# EAGLE schematic XbeeToI2C (EAGLE 7.1.0)
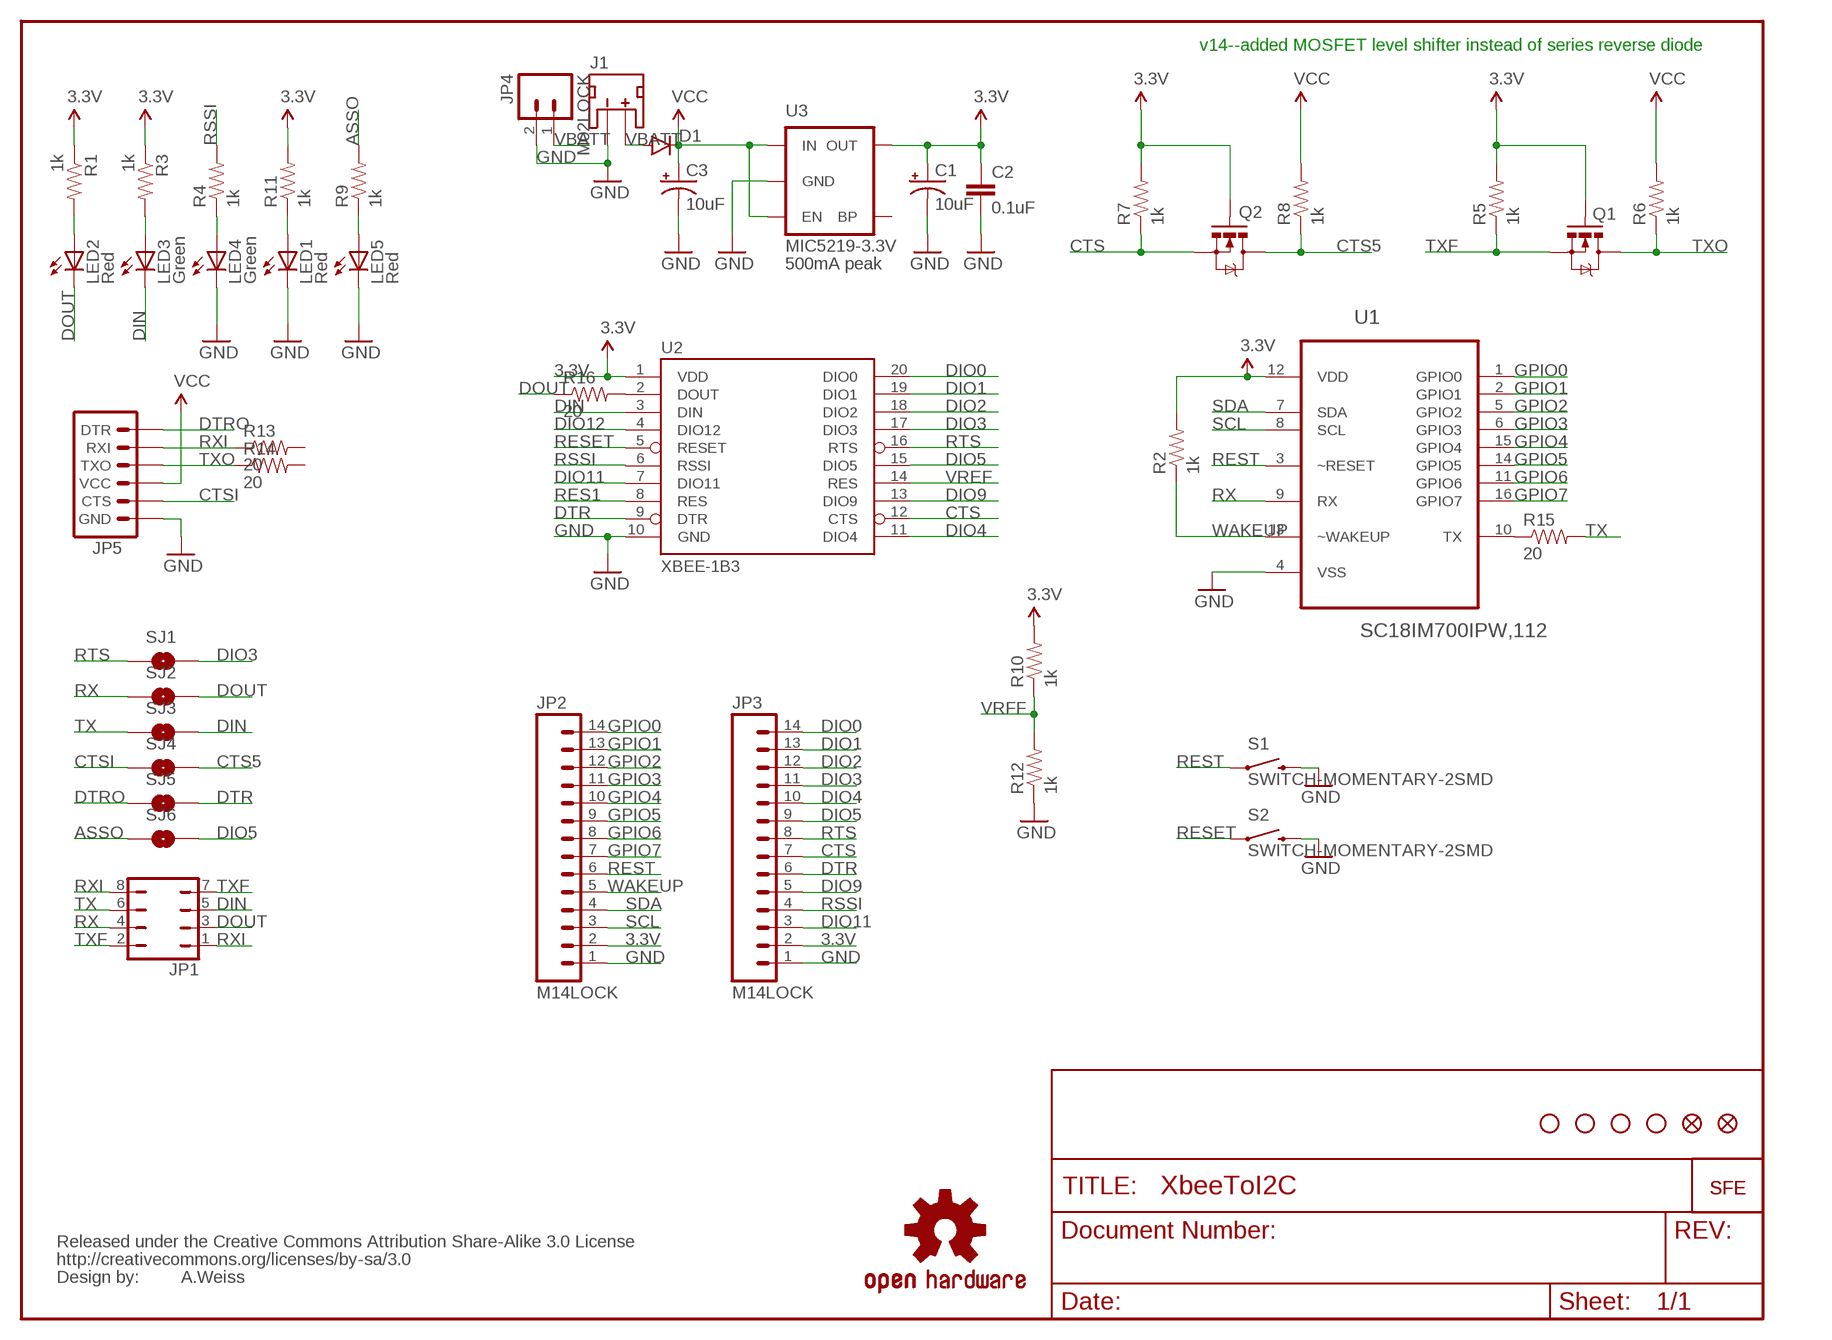
[diagram p0: schematic, sheet 1]

## Parts
C1  10uF  CAP_POL1206  [EIA3216]
C2  0.1uF  CAP0402-CAP  [0402-CAP]
C3  10uF  CAP_POL1206  [EIA3216]
D1  DIODESMA  [SMA-DIODE]
J1  JST_2MM_MALE  [JST-2-SMD]
JP1  JP4Q  [JP4Q]
JP2  M14LOCK  [1X14_LOCK]
JP3  M14LOCK  [1X14_LOCK]
JP4  M02LOCK  [1X02_LOCK]
JP5  ARDUINO_SERIAL_PROGRAMSMD  [1X06-SMD]
LED1  Red  LED0603  [LED-0603]
LED2  Red  LED0603  [LED-0603]
LED3  Green  LED0603  [LED-0603]
LED4  Green  LED0603  [LED-0603]
LED5  Red  LED0603  [LED-0603]
Q1  MOSFET-NCHANNELSMD  [SOT23-3@1]
Q2  MOSFET-NCHANNELSMD  [SOT23-3@1]
R1  1k  RESISTOR0402-RES  [0402-RES]
R2  1k  RESISTOR0402-RES  [0402-RES]
R3  1k  RESISTOR0402-RES  [0402-RES]
R4  1k  RESISTOR0402-RES  [0402-RES]
R5  1k  RESISTOR0402-RES  [0402-RES]
R6  1k  RESISTOR0402-RES  [0402-RES]
R7  1k  RESISTOR0402-RES  [0402-RES]
R8  1k  RESISTOR0402-RES  [0402-RES]
R9  1k  RESISTOR0402-RES  [0402-RES]
R10  1k  RESISTOR0402-RES  [0402-RES]
R11  1k  RESISTOR0402-RES  [0402-RES]
R12  1k  RESISTOR0402-RES  [0402-RES]
R13  20  20OHM1/10W1%(0603)SMD  [0603-RES]
R14  20  20OHM1/10W1%(0603)SMD  [0603-RES]
R15  20  20OHM1/10W1%(0603)SMD  [0603-RES]
R16  20  20OHM1/10W1%(0603)SMD  [0603-RES]
S1  SWITCH-MOMENTARY-2SMD  [TACTILE-SWITCH-SMD]
S2  SWITCH-MOMENTARY-2SMD  [TACTILE-SWITCH-SMD]
SJ1  SOLDERJUMPERNO  [SJ_2S-NO]
SJ2  SOLDERJUMPERNO  [SJ_2S-NO]
SJ3  SOLDERJUMPERNO  [SJ_2S-NO]
SJ4  SOLDERJUMPERNO  [SJ_2S-NO]
SJ5  SOLDERJUMPERNO  [SJ_2S-NO]
SJ6  SOLDERJUMPERNO  [SJ_2S-NO]
U1  SC18IM700IPW,112  [SOP65P640X110-16N]
U2  XBEE-1B3  [XBEE-SMD]
U3  V_REG_LDOSMD  [SOT23-5]
U$1  LOGO-SFESK  [SFE-LOGO-FLAME]
U$3  OSHW-LOGOS  [OSHW-LOGO-S]
U$4  LOGO-SFENEW  [SFE-NEW-WEBLOGO]
U$5  STAND-OFF  [STAND-OFF]
U$7  FIDUCIAL1X2  [FIDUCIAL-1X2]
U$8  CREATIVE_COMMONS  [CREATIVE_COMMONS]
U$9  STAND-OFF  [STAND-OFF]
U$10  STAND-OFF  [STAND-OFF]
U$11  STAND-OFF  [STAND-OFF]
U$16  FIDUCIAL1X2  [FIDUCIAL-1X2]

## Nets
3.3V [vcc]: C1.A(+) C2.1 JP2.2 JP3.2 Q1.1(G) Q2.1(G) R1.1 R2.2 R3.1 R5.2 R7.2 R10.2 R11.2 U1.12(VDD) U2.1(VDD) U3.5(OUT)
ASSO: R9.2 SJ6.1
CTS: JP3.7 Q2.2(S) R7.1 U2.12(CTS)
CTS5: Q2.3(D) R8.1 SJ4.2
CTSI [vcc]: JP5.5(CTS) SJ4.1
DIN: JP1.5 LED3.C SJ3.2 U2.3(DIN)
DIO0: JP3.14 U2.20(DIO0)
DIO1: JP3.13 U2.19(DIO1)
DIO2: JP3.12 U2.18(DIO2)
DIO3: JP3.11 SJ1.2 U2.17(DIO3)
DIO4: JP3.10 U2.11(DIO4)
DIO5: JP3.9 SJ6.2 U2.15(DIO5)
DIO9: JP3.5 U2.13(DIO9)
DIO11: JP3.3 U2.7(DIO11)
DIO12: U2.4(DIO12)
DOUT: JP1.3 LED2.C R16.1 SJ2.2
DTR: JP3.6 SJ5.2 U2.9(DTR)
DTRO: JP5.1(DTR) SJ5.1
GND [vcc]: C1.C(-) C2.2 C3.C(-) J1.1(-) JP2.1 JP3.1 JP4.2 JP5.6(GND) LED1.C LED4.C LED5.C R12.1 S1.3 S2.3 U1.4(VSS) U2.10(GND) U3.2(GND)
GPIO0: JP2.14 U1.1(GPIO0)
GPIO1: JP2.13 U1.2(GPIO1)
GPIO2: JP2.12 U1.5(GPIO2)
GPIO3: JP2.11 U1.6(GPIO3)
GPIO4: JP2.10 U1.15(GPIO4)
GPIO5: JP2.9 U1.14(GPIO5)
GPIO6: JP2.8 U1.11(GPIO6)
GPIO7: JP2.7 U1.16(GPIO7)
N$1: LED2.A R1.2
N$2: LED4.A R4.1
N$3: R16.2 U2.2(DOUT)
N$4: LED3.A R3.2
N$5: R15.1 U1.10(TX)
N$18: LED5.A R9.1
N$38: LED1.A R11.1
RES1: U2.8(RES)
RESET: S2.1 U2.5(RESET)
REST: JP2.6 S1.1 U1.3(~RESET)
RSSI: JP3.4 R4.2 U2.6(RSSI)
RTS: JP3.8 SJ1.1 U2.16(RTS)
RX: JP1.4 SJ2.1 U1.9(RX)
RXI: JP1.1 JP1.8 JP5.2(RXI) R13.1
SCL: JP2.3 U1.8(SCL)
SDA: JP2.4 U1.7(SDA)
TX: JP1.6 R15.2 SJ3.1
TXF: JP1.2 JP1.7 Q1.2(S) R5.1
TXO: JP5.3(TXO) Q1.3(D) R6.1 R14.1
VBATT: D1.A J1.2(+) JP4.1
VCC [vcc]: C3.A(+) D1.C JP5.4(VCC) R6.2 R8.2 U3.1(IN) U3.3(EN)
VREF: U2.14(RES)
VRFF: R10.1 R12.2
WAKEUP: JP2.5 R2.1 U1.13(~WAKEUP)
Unconnected: J1.NC1(PAD1) J1.NC2(PAD2) R13.2 R14.2 U3.4(BP)

## Notes on the sheet
- v14--added MOSFET level shifter instead of series reverse diode
- MIC5219-3.3V
- 500mA peak
- A.Weiss

## Library data of the parts
C1 C3 = SparkFun:CAP_POL: Capacitor Polarized These are standard SMD and PTH capacitors. Normally 10uF, 47uF, and 100uF in electrolytic and tantalum varieties. Always verify the external diameter of the through hole cap, it varies with capacity, voltage, and manufacturer. The EIA devices should be standard.
C2 = SparkFun:CAP: Capacitor Standard 0603 ceramic capacitor, and 0.1" leaded capacitor.
D1 = SparkFun-DiscreteSemi:DIODE: Diode These are standard reverse protection diodes and small signal diodes. SMA package can handle up to about 1A. SOD-323 can handle about 200mA. What the SOD-323 package when ordering, there are some mfgs out there that are 5-pin packages.
J1 = SparkFun-Connectors:JST_2MM_MALE: Mates to single-cell LiPo batteries. CONN-08352; PROD_ID: CONN-08352
JP1 = jumper:JP4Q: JUMPER
JP2 JP3 = SparkFun-Connectors:M14: Header 14 Standard 14-pin 0.1" header. Use with straight break away headers (SKU : PRT-00116), right angle break away headers (PRT-00553), swiss pins (PRT-00743), machine pins (PRT-00117), and female headers (PRT-00115).
JP4 = SparkFun-Connectors:M02: Standard 2-pin 0.1" header. Use with - straight break away headers ( PRT-00116) - right angle break away headers (PRT-00553) - swiss pins (PRT-00743) - machine pins (PRT-00117) - female headers (PRT-00115) Molex polarized connector foot print use with: PRT-08233 with associated crimp pins and housings. 2.54_SCREWTERM for use with PRT-10571. 3.5mm Screw Terminal footprints for PRT-08084 5mm Screw Terminal footprints for use with PRT-08432
JP5 = SparkFun-Connectors:ARDUINO_SERIAL_PROGRAM: FTDI connector footprints
LED1-LED5 = SparkFun:LED: LEDs Standard schematic elements and footprints for 5mm, 3mm, 1206, and 0603 sized LEDs. 5mm - Spark Fun Electronics SKU : COM-00529 (and others)
Q1 Q2 = SparkFun-DiscreteSemi:MOSFET-NCHANNEL: Generic NMOS footprint
R1-R12 = SparkFun:RESISTOR: Resistor Basic schematic elements and footprints for 0603, 1206, and PTH 1/10th watt (small) resistors.
R13-R16 = SparkFun-Resistors:20OHM1/10W1%(0603): RES-07862; PROD_ID: RES-07862
S1 S2 = SparkFun-Electromechanical:SWITCH-MOMENTARY-2: Various NO switches- pushbuttons, reed, etc
SJ1-SJ6 = SparkFun:SOLDERJUMPER: Solder Jumper Standard SMD solder jumper. Used to automate production. Two varients : Normally Open and Normally Closed are the same, but have different paste layers. NC will have a large amount of paste and should jumper during reflow.
U1 = NXP_By_element14_Batch_1:SC18IM700IPW,112: Master I2C-bus controller with UART interface; MPN: SC18IM700IPW,112; OC_FARNELL: -; OC_NEWARK: 70R9006; PACKAGE: TSSOP-16; SUPPLIER: NXP
U2 = SparkFun:XBEE-1
U3 = SparkFun:V_REG_LDO: Voltage Regulator LDO Standard 150mA LDO voltage regulator in SOT-23 layout. Micrel part MIC5205. BP (by-pass) pin is used to lower output noise with 470pF cap.
U$1 U$4 = SparkFun:LOGO-SFE: Spark Fun Electronics PCB Logo This is the standard Spark Fun Electronics PCB logo.
U$3 = SparkFun-Aesthetics:OSHW-LOGO: Open Source Hardware Logo This logo indicates the piece of hardware it is found on incorporates a OSHW license and/or adheres to the definition of open source hardware found here: http://freedomdefined.org/OSHW
U$5 U$9-U$11 = SparkFun:STAND-OFF: Stand Off This is the mechanical footprint for a #4 phillips button head screw. Use the keepout ring to avoid running the screw head into surrounding components. SKU : PRT-00447
U$7 U$16 = SparkFun:FIDUCIAL: Fiducial Alignment Points Various fiducial points for machine vision alignment.
U$8 = SparkFun-Aesthetics:CREATIVE_COMMONS: Creative Commons License summary

## Net classes
0 default: width 0.203 mm
1 vcc: width 0.305 mm
2 gnd: width 0.254 mm